# Altium schematic sheet PIC32_NVME.SchDoc
size A4; SheetNumber: 1; SheetTotal: 6
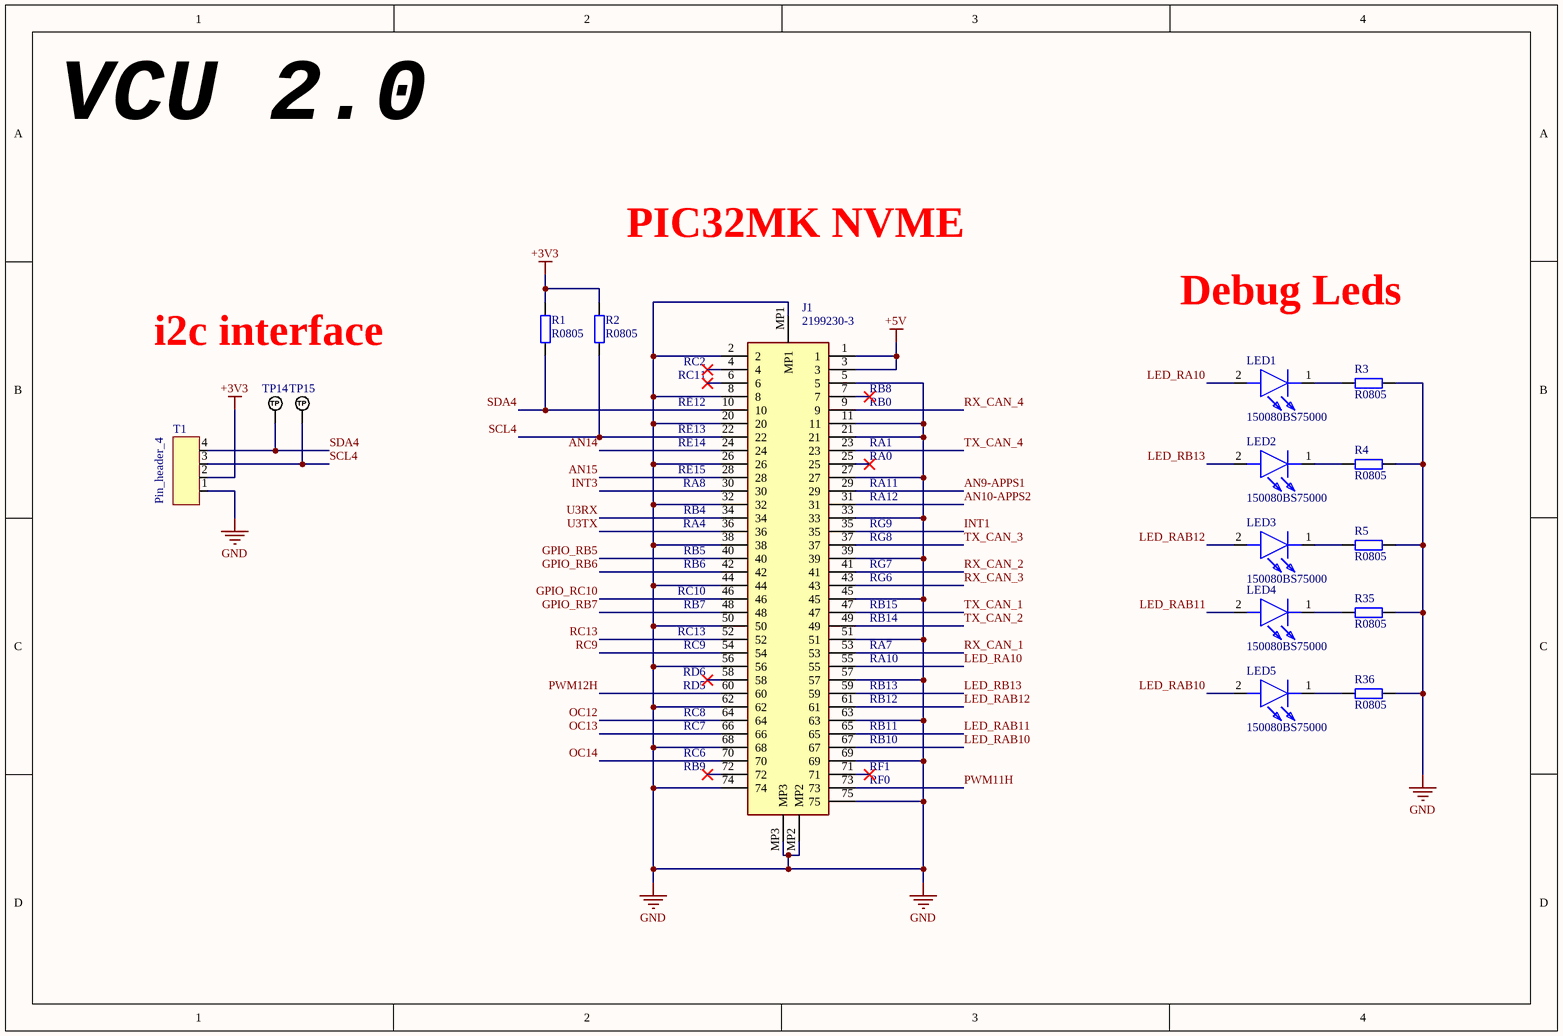
[diagram p0: PIC32_NVME.SchDoc]

## Parts
J1  2199230-3  [21992303]
LED1  150080BS75000  [LEDC2012X80N]
LED2  150080BS75000  [LEDC2012X80N]
LED3  150080BS75000  [LEDC2012X80N]
LED4  150080BS75000  [LEDC2012X80N]
LED5  150080BS75000  [LEDC2012X80N]
R1  R0805  [RES_0805]
R2  R0805  [RES_0805]
R3  R0805  [RES_0805]
R4  R0805  [RES_0805]
R5  R0805  [RES_0805]
R35  R0805  [RES_0805]
R36  R0805  [RES_0805]
T1  Pin_header_4  [Pin_header_4]
TP14  TP_NOBOM  [PAD_RND_1MM]  (value not drawn)  (no BOM)
TP15  TP_NOBOM  [PAD_RND_1MM]  (value not drawn)  (no BOM)

## Nets
+3V3: R1.1 R2.1 T1.2
+5V: J1.1 J1.3
GND: J1.2 J1.5 J1.8 J1.11 J1.20 J1.21 J1.26 J1.27 J1.32 J1.33 J1.38 J1.39 J1.44 J1.45 J1.50 J1.51 J1.56 J1.57 J1.62 J1.63 J1.68 J1.69 J1.74 J1.75 J1.MP1 J1.MP2 J1.MP3 R3.1 R4.1 R5.1 R35.1 R36.1 T1.1
AN9-APPS1: J1.29
AN10-APPS2: J1.31
AN14: J1.24
AN15: J1.28
GPIO_RB5: J1.40
GPIO_RB6: J1.42
GPIO_RB7: J1.48
GPIO_RC10: J1.46
INT1: J1.35
INT3: J1.30
LED_RA10: J1.55 LED1.2(A)
LED_RAB10: J1.67 LED5.2(A)
LED_RAB11: J1.65 LED4.2(A)
LED_RAB12: J1.61 LED3.2(A)
LED_RB13: J1.59 LED2.2(A)
OC12: J1.64
OC13: J1.66
OC14: J1.70
PWM11H: J1.73
PWM12H: J1.60
RC9: J1.54
RC13: J1.52
RX_CAN_1: J1.53
RX_CAN_2: J1.41
RX_CAN_3: J1.43
RX_CAN_4: J1.9
SCL4: J1.22 R2.2 T1.3 TP15.1(TP)
SDA4: J1.10 R1.2 T1.4 TP14.1(TP)
TX_CAN_1: J1.47
TX_CAN_2: J1.49
TX_CAN_3: J1.37
TX_CAN_4: J1.23
U3RX: J1.34
U3TX: J1.36
NetLED1_1: LED1.1(K) R3.2
NetLED2_1: LED2.1(K) R4.2
NetLED3_1: LED3.1(K) R5.2
NetLED4_1: LED4.1(K) R35.2
NetLED5_1: LED5.1(K) R36.2

Not connected (* = marked no-connect by the designer): J1 4* 6* 7* 25* 58* 71* 72*

## Notes on the sheet
- VCU 2.0
- PIC32MK NVME
- Debug Leds
- i2c interface
- (near J1) RC2
- (near J1) RC11
- (near J1) RE12
- (near J1) RE13
- (near J1) RE14
- (near J1) RB0
- (near J1) RA1
- (near J1) RB8
- (near J1) RE15
- (near J1) RA8
- (near J1) RB4
- (near J1) RA0
- (near J1) RA11
- (near J1) RA12
- (near J1) RA4
- (near J1) RB5
- (near J1) RB6
- (near J1) RG7
- (near J1) RG8
- (near J1) RG6
- (near J1) RG9
- (near J1) RC10
- (near J1) RB7
- (near J1) RC13
- (near J1) RC9
- (near J1) RA7
- (near J1) RB15
- (near J1) RB14
- (near J1) RD6
- (near J1) RD5
- (near J1) RC8
- (near J1) RA10
- (near J1) RB13
- (near J1) RB12
- (near J1) RC7
- (near J1) RC6
- (near J1) RB9
- (near J1) RB11
- (near J1) RB10
- (near J1) RF1
- (near J1) RF0

## Library data of the parts
J1 = 2199230-3: Connector; Manufacturer_Name: TE Connectivity; Datasheet Link: https://componentsearchengine.com/Datasheets/2/2199230-3.pdf; Height: 4.2mm; Manufacturer_Part_Number: 2199230-3; Mouser Part Number: 571-2199230-3; Mouser Price/Stock: https://www.mouser.co.uk/ProductDetail/TE-Connectivity/2199230-3?qs=EQCnRgr4b6HElQOKr5ma1Q%3D%3D; Arrow Part Number: 2199230-3; Arrow Price/Stock: https://www.arrow.com/en/products/2199230-3/te-connectivity?region=nac
LED1-LED5 = 150080BS75000: LED; Manufacturer_Name: Wurth Elektronik; Datasheet Link: https://katalog.we-online.com/led/datasheet/150080BS75000.pdf; Height: 0.8mm; Manufacturer_Part_Number: 150080BS75000; Mouser Part Number: 710-150080BS75000; Mouser Price/Stock: https://www.mouser.co.uk/ProductDetail/Wurth-Elektronik/150080BS75000?qs=2kOmHSv6VfT2tBo3UPVqAQ%3D%3D
R1-R5 R35 R36 = RES_0805: Resistor SMD 0805; Manufacturer: *; Manufacturer Part Number: *; Distributor Link: *; LCSC: *
TP14 TP15 = TEST_POINT_RND_1MM: Test Point Round 1mm (NO BOM)